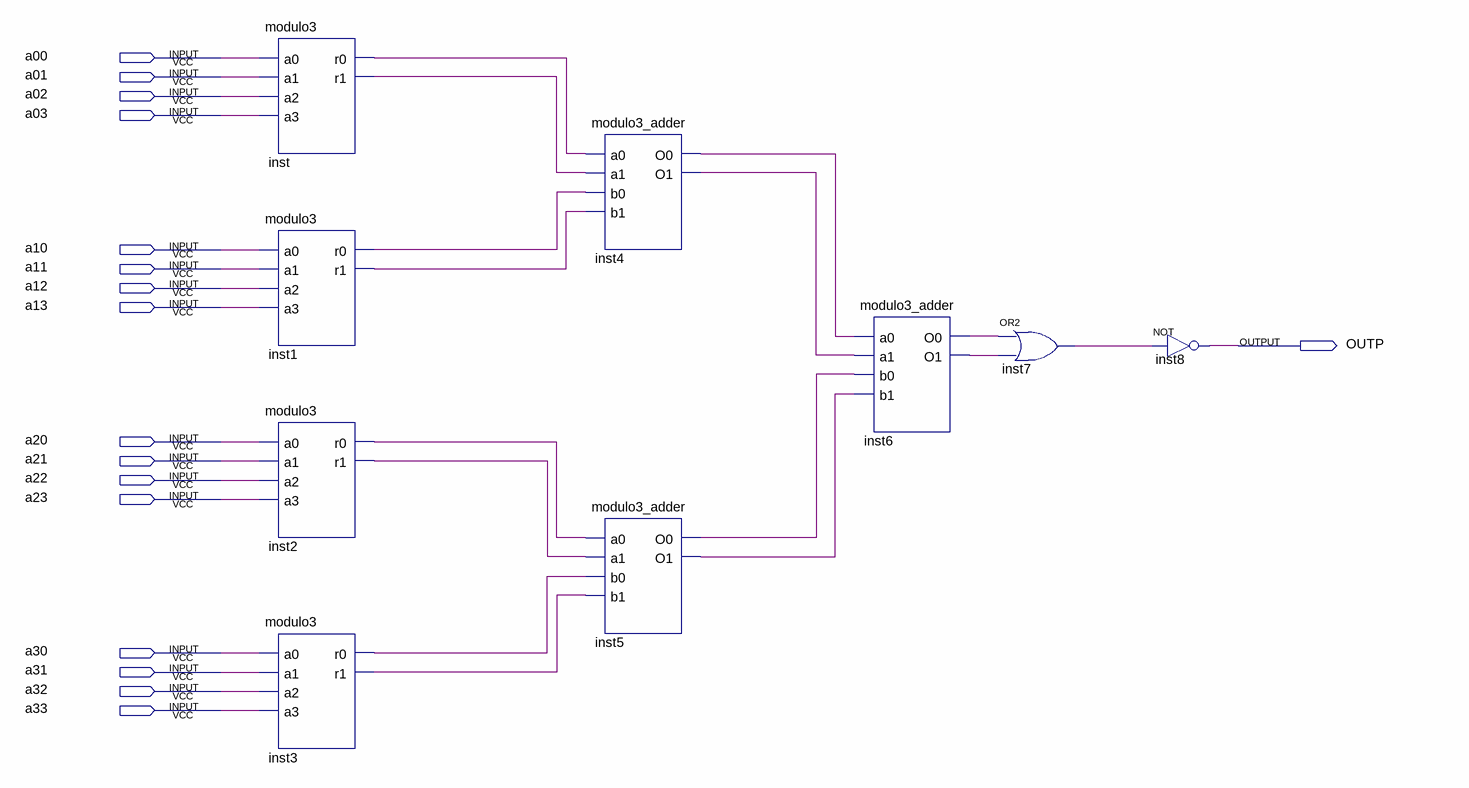
[diagram p0: schematic sheet]
// Quartus schematic multiple3.bdf as structural Verilog: 9 symbols, 17 pins
module multiple3 (
  input  a00,
  input  a01,
  input  a02,
  input  a03,
  input  a10,
  input  a11,
  input  a12,
  input  a13,
  input  a20,
  input  a21,
  input  a22,
  input  a23,
  input  a30,
  input  a31,
  input  a32,
  input  a33,
  output OUTP
);

  wire inst1_r0, inst1_r1, inst2_r0, inst2_r1, inst3_r0, inst3_r1, inst4_o0, inst4_o1, inst5_o0, inst5_o1,
       inst6_o0, inst6_o1, inst7_out, inst_r0, inst_r1;

  modulo3 inst (.a0(a00), .a1(a01), .a2(a02), .a3(a03), .r0(inst_r0), .r1(inst_r1));
  modulo3 inst1 (.a0(a10), .a1(a11), .a2(a12), .a3(a13), .r0(inst1_r0), .r1(inst1_r1));
  modulo3 inst2 (.a0(a20), .a1(a21), .a2(a22), .a3(a23), .r0(inst2_r0), .r1(inst2_r1));
  modulo3 inst3 (.a0(a30), .a1(a31), .a2(a32), .a3(a33), .r0(inst3_r0), .r1(inst3_r1));
  modulo3_adder inst4 (.a0(inst_r0), .a1(inst_r1), .b0(inst1_r0), .b1(inst1_r1), .O0(inst4_o0), .O1(inst4_o1));
  modulo3_adder inst5 (.a0(inst2_r0), .a1(inst2_r1), .b0(inst3_r0), .b1(inst3_r1), .O0(inst5_o0), .O1(inst5_o1));
  modulo3_adder inst6 (.a0(inst4_o0), .a1(inst4_o1), .b0(inst5_o0), .b1(inst5_o1), .O0(inst6_o0), .O1(inst6_o1));
  or inst7 (inst7_out, inst6_o0, inst6_o1);
  not inst8 (OUTP, inst7_out);
endmodule
